# EAGLE design R401D (EAGLE 6.6.0)
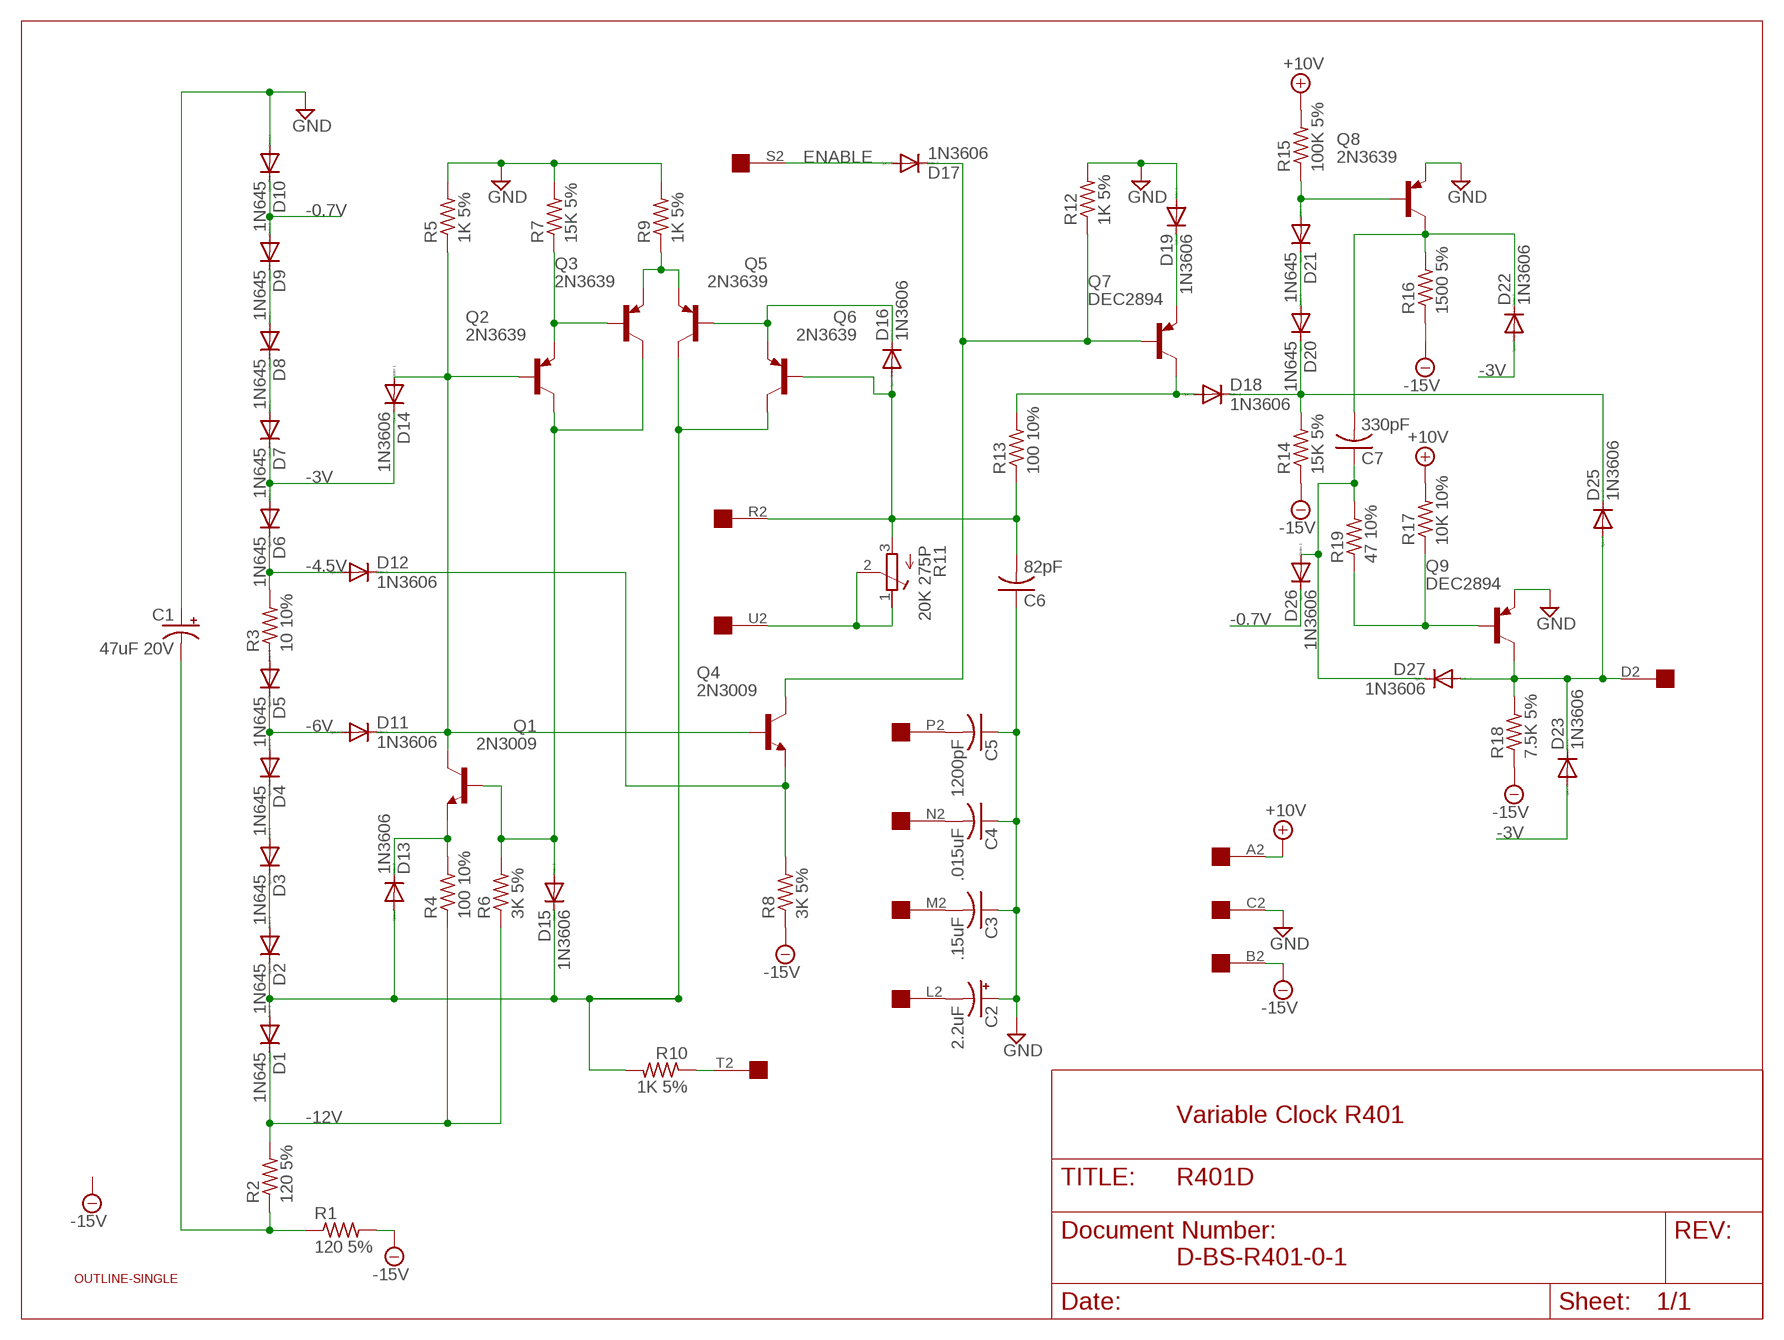
[diagram p0: schematic, sheet 1]

## Parts
C1  47uF 20V  CPOL-USE22-6AXIAL  [E22-6]
C2  2.2uF  CPOL-USE12-4AXIAL  [E12-4]
C3  .15uF  C-US275-093X316  [C275-093X316]
C4  .015uF  C-US150-054X183  [C150-054X183]
C5  1200pF  C-US102-043X133  [C102-043X133]
C6  82pF  C-US075-032X103  [C075-032X103]
C7  330pF  C-US075-032X103  [C075-032X103]
D1  1N645  1N4148DO35-10  [DO35-10]
D2  1N645  1N4148DO35-10  [DO35-10]
D3  1N645  1N4148DO35-10  [DO35-10]
D4  1N645  1N4148DO35-10  [DO35-10]
D5  1N645  1N4148DO35-10  [DO35-10]
D6  1N645  1N4148DO35-10  [DO35-10]
D7  1N645  1N4148DO35-10  [DO35-10]
D8  1N645  1N4148DO35-10  [DO35-10]
D9  1N645  1N4148DO35-10  [DO35-10]
D10  1N645  1N4148DO35-10  [DO35-10]
D11  1N3606  1N4148DO35-10  [DO35-10]
D12  1N3606  1N4148DO35-10  [DO35-10]
D13  1N3606  1N4148DO35-10  [DO35-10]
D14  1N3606  1N4148DO35-10  [DO35-10]
D15  1N3606  1N4148DO35-10  [DO35-10]
D16  1N3606  1N4148DO35-10  [DO35-10]
D17  1N3606  1N4148DO35-10  [DO35-10]
D18  1N3606  1N4148DO35-10  [DO35-10]
D19  1N3606  1N4148DO35-10  [DO35-10]
D20  1N645  1N4148DO35-10  [DO35-10]
D21  1N645  1N4148DO35-10  [DO35-10]
D22  1N3606  1N4148DO35-10  [DO35-10]
D23  1N3606  1N4148DO35-10  [DO35-10]
D25  1N3606  1N4148DO35-10  [DO35-10]
D26  1N3606  1N4148DO35-10  [DO35-10]
D27  1N3606  1N4148DO35-10  [DO35-10]
Q1  2N3009  2N2102  [TO5]
Q2  2N3639  2N2904  [TO39]
Q3  2N3639  2N2904  [TO39]
Q4  2N3009  2N2102  [TO5]
Q5  2N3639  2N2904  [TO39]
Q6  2N3639  2N2904  [TO39]
Q7  DEC2894  2N2904  [TO39]
Q8  2N3639  2N2904  [TO39]
Q9  DEC2894  2N2904  [TO39]
R1  120 5%  R-US_0207/10  [0207/10]
R2  120 5%  R-US_0207/10  [0207/10]
R3  10 10%  R-US_0207/10  [0207/10]
R4  100 10%  R-US_0207/10  [0207/10]
R5  1K 5%  R-US_0207/10  [0207/10]
R6  3K 5%  R-US_0207/10  [0207/10]
R7  15K 5%  R-US_0207/10  [0207/10]
R8  3K 5%  R-US_0207/10  [0207/10]
R9  1K 5%  R-US_0207/10  [0207/10]
R10  1K 5%  R-US_0207/10  [0207/10]
R11  20K 275P  275P  [3006Y]
R12  1K 5%  R-US_0207/10  [0207/10]
R13  100 10%  R-US_0207/10  [0207/10]
R14  15K 5%  R-US_0207/10  [0207/10]
R15  100K 5%  R-US_0207/10  [0207/10]
R16  1500 5%  R-US_0207/10  [0207/10]
R17  10K 10%  R-US_0207/10  [0207/10]
R18  7.5K 5%  R-US_0207/10  [0207/10]
R19  47 10%  R-US_0207/10  [0207/10]
U$1  OUTLINE-SINGLE  [SINGLE]
U$2  EDGE-1  [EDGE-CON1]

## Nets
+10V [Supply]: R15.2 R17.2 U$2.A2
-0.7V [Supply]: D9.A D10.C D26.C
-3V [Supply]: D6.A D7.C D14.C D22.A D23.A
-4.5V [Supply]: D6.C D12.A R3.2
-6V [Supply]: D4.A D5.C D11.A
-12V [Supply]: D1.C R2.2 R4.1 R6.1
-15V [Supply]: R1.2 R8.1 R14.1 R16.1 R18.1 U$2.B2
ENABLE: D17.A U$2.S2
GND [Supply]: C1.+ C2.+ C3.1 C4.1 C5.1 C6.1 D10.A D19.A Q8.1(E) Q9.1(E) R5.2 R7.2 R9.2 R12.2 U$2.C2
N$1 [Supply]: C1.- R1.1 R2.1
N$6: D5.A R3.1
N$7: D11.C D14.A Q1.3(C) Q2.2(B) Q4.2(B) R5.1
N$8 [Supply]: D8.A D9.C
N$9 [Supply]: D7.A D8.C
N$10: D13.C Q1.1(E) R4.2
N$11: D15.A Q1.2(B) Q2.3(C) Q3.3(C) R6.2
N$12 [Supply]: D1.A D2.C D13.A D15.C Q5.3(C) Q6.3(C) R10.2
N$13 [Supply]: D2.A D3.C
N$14 [Supply]: D3.A D4.C
N$15: Q2.1(E) Q3.2(B) R7.1
N$16: Q3.1(E) Q5.1(E) R9.1
N$17: D12.C Q4.1(E) R8.2
N$18: D16.C Q5.2(B) Q6.1(E)
N$19: C6.2 D16.A Q6.2(B) R11.3(E) R13.1 U$2.R2
N$20: R11.1(A) R11.2(S) U$2.U2
N$21: D17.C Q4.3(C) Q7.2(B) R12.1
N$22: D19.C Q7.1(E)
N$23: D18.A Q7.3(C) R13.2
N$24: C4.2 U$2.N2
N$25: D23.C D25.A D27.A Q9.3(C) R18.2 U$2.D2
N$26: C3.2 U$2.M2
N$27: C2.- U$2.L2
N$28: C5.2 U$2.P2
N$29: D21.A Q8.2(B) R15.1
N$30: D20.A D21.C
N$32: C7.2 D22.C Q8.3(C) R16.2
N$33: D18.C D20.C D25.C R14.2
N$34: Q9.2(B) R17.1 R19.1
N$35: C7.1 D26.A D27.C R19.2
N$37: R10.1 U$2.T2
Unconnected: U$2.E2 U$2.F2 U$2.H2 U$2.J2 U$2.K2 U$2.V2

## Notes on the sheet
- Variable Clock R401
- D-BS-R401-0-1

## Library data of the parts
C1 = rcl:CPOL-US: POLARIZED CAPACITOR, American symbol
C2 = dec-con:CPOL-USE12-4AXIAL: 0.5" veresion of an electrolytic
C3-C7 = rcl:C-US: CAPACITOR, American symbol
D1-D23 D25-D27 = diode:1N4148: DIODE high speed (Philips)
Q1 Q4 = transistor-npn:2N2102: NPN Transistor
Q2 Q3 Q5-Q9 = transistor-pnp:2N2904*: PNP Transistror
R1-R10 R12-R19 = rcl:R-US_: RESISTOR, American symbol
R11 = dec-con:275P: Trimpot with 275P (3006Y) footprint.
U$1 = dec-con:OUTLINE-*: Board outlines for DEC boards.
U$2 = dec-con:EDGE-1: Single-Sided DEC Edge Connector -- (side 2)

## Net classes
1 Supply: width 0.813 mm

## Board
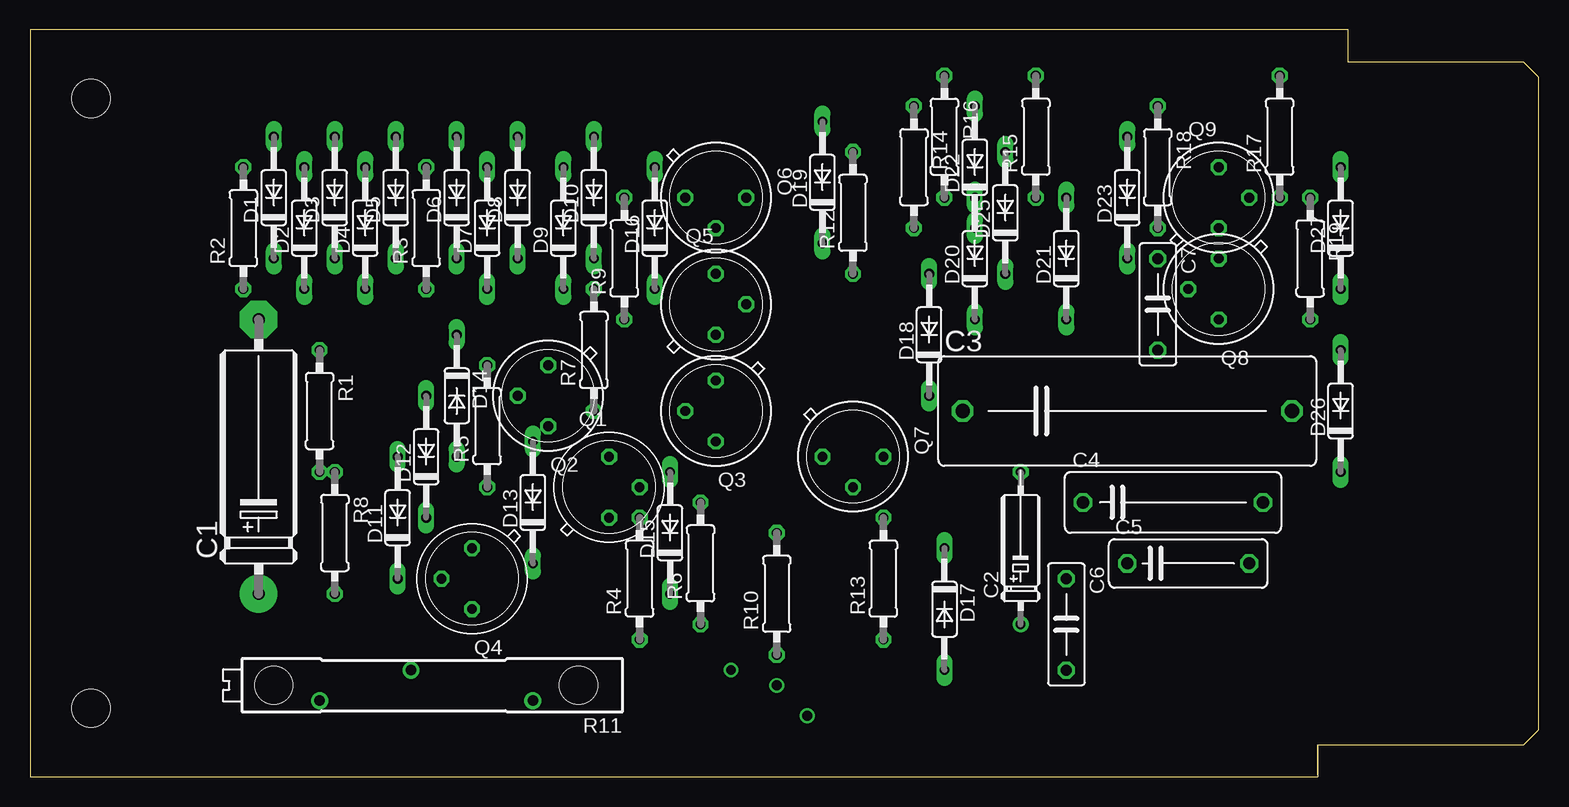
[diagram p1: board, top side]
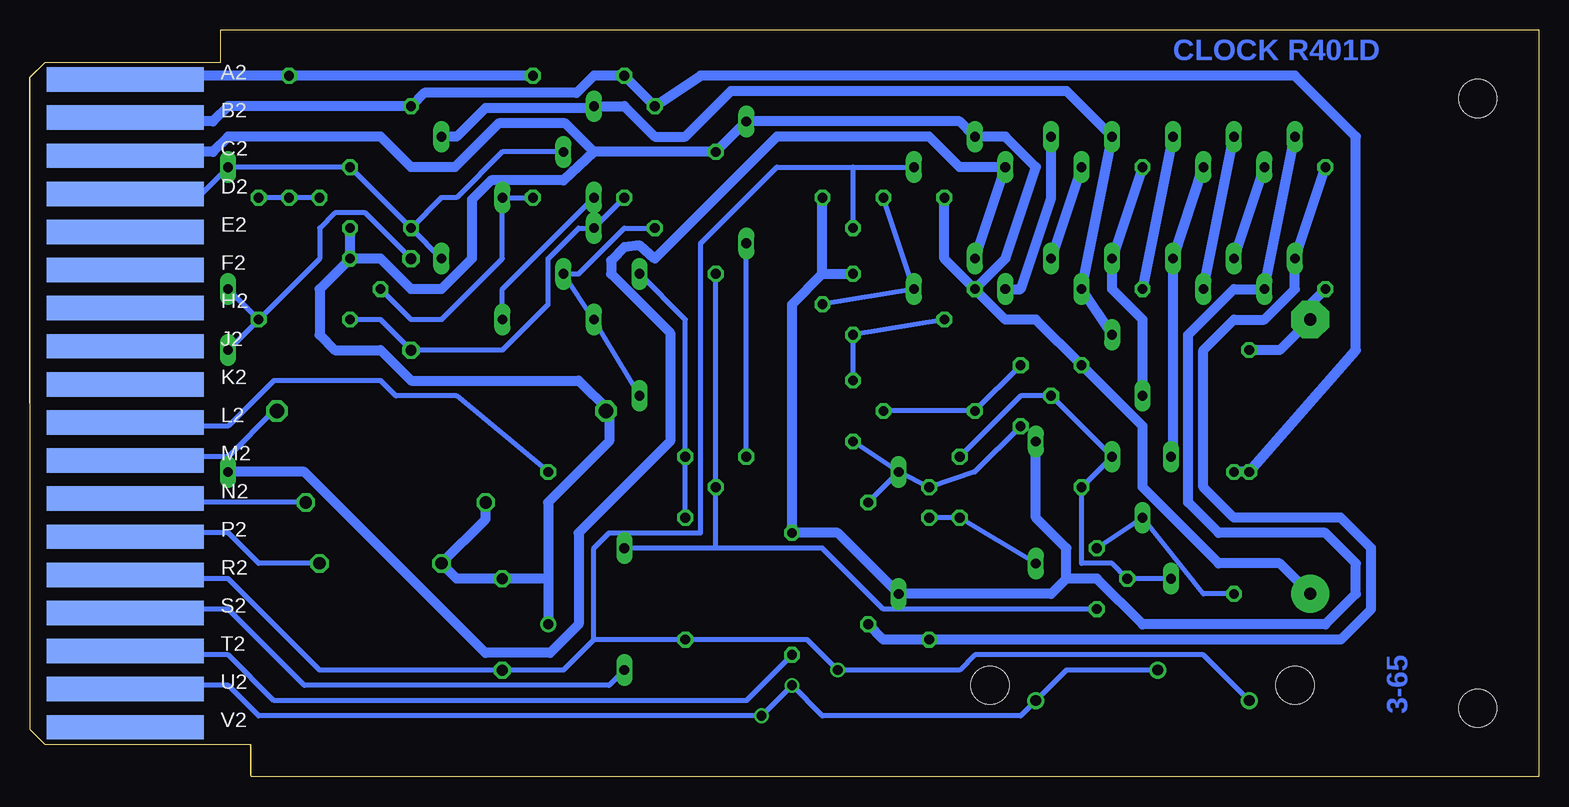
[diagram p2: board, bottom side, seen from below]

Size 125.73 x 62.23 mm. Coordinates in mm from the lower left corner, seen from the top.
Copper layers (1+16): Top 0.035mm / dielectric 1.5mm / Bottom 0.035mm
Design rules "16mils": minimum track width 16mil, minimum drill 32mil, track to track 15mil, track to pad 10mil, pad to pad 10mil, via to via 10mil, smd to smd 10mil, copper to edge 13mil, drill to drill 10mil, minimum pad ring 10mil, minimum via ring 8mil, stop-mask expansion 0mil, vias tented up to drill 0mil, thermal gap 10mil
Holes 3.17 mm at 20.32,7.62 45.72,7.62

### Footprints (pad centres in the part's own frame; a part is rotated, then mirrored left to right if it is on the bottom)
E22-6 = drill 1.016 pad 3.15: + -11.43,0 | drill 1.016 pad 3.15 octagon: - 11.43,0
E12-4 = drill 0.813: + -7.62,0 | drill 0.813 octagon: - 5.08,0
C275-093X316 = drill 1.194 octagon: 1 -13.716,0; 2 13.716,0
C150-054X183 = drill 1.016 octagon: 1 -7.493,0; 2 7.493,0
C102-043X133 = drill 1.016 octagon: 1 -5.08,0; 2 5.08,0
C075-032X103 = drill 0.914 octagon: 1 -3.81,0; 2 3.81,0
DO35-10 = drill 0.813 long: A 5.08,0; C -5.08,0
TO5 = drill 0.813 octagon: 1 0,-2.54; 2 2.54,0; 3 0,2.54
TO39 = drill 0.813 octagon: 1 0,-2.54; 2 2.54,0; 3 0,2.54
0207/10 = drill 0.813 octagon: 1 -5.08,0; 2 5.08,0
3006Y = drill 0.9: 1 -8.89,1.27; 2 1.27,-1.27; 3 8.89,1.27
SINGLE = hole 3.175: 120.65,56.515; 120.65,5.715
EDGE-CON1 = smd 13.106 x 2.032 bottom: A2 7.938,4.128; B2 7.938,7.303; C2 7.938,10.477; D2 7.938,13.652; E2 7.938,16.828; F2 7.938,20.003; H2 7.938,23.177; J2 7.938,26.352; K2 7.938,29.527; L2 7.938,32.703; M2 7.938,35.877; N2 7.938,39.053; P2 7.938,42.227; R2 7.938,45.403; S2 7.938,48.578; T2 7.938,51.752; U2 7.938,54.928; V2 7.938,58.102

### Placement (x,y rotation side)
C1  19.05,26.67 90 top
C2  82.55,20.32 90 top
C3  91.44,30.48 0 top
C4  95.25,22.86 0 top
C5  96.52,17.78 0 top
C6  86.36,12.7 270 top
C7  93.98,39.37 270 top
D1  20.32,48.26 90 top
D2  22.86,45.72 90 top
D3  25.4,48.26 90 top
D4  27.94,45.72 90 top
D5  30.48,48.26 90 top
D6  35.56,48.26 90 top
D7  38.1,45.72 90 top
D8  40.64,48.26 90 top
D9  44.45,45.72 90 top
D10  46.99,48.26 90 top
D11  30.64,21.59 90 top
D12  33.02,26.67 90 top
D13  41.91,22.86 90 top
D14  35.56,31.75 270 top
D15  53.34,20.32 90 top
D16  52.07,45.72 90 top
D17  76.2,13.97 270 top
D18  74.93,36.83 90 top
D19  66.04,49.53 90 top
D20  78.74,43.18 90 top
D21  86.36,43.18 90 top
D22  78.74,50.8 90 top
D23  91.44,48.26 90 top
D25  81.28,46.99 90 top
D26  109.22,30.48 90 top
D27  109.22,45.72 90 top
Q1  48.26,24.13 0 top
Q2  43.18,31.75 180 top
Q3  57.15,30.48 180 top
Q4  36.83,16.51 180 top
Q5  57.15,39.37 0 top
Q6  57.15,48.26 270 top
Q7  68.58,26.67 270 top
Q8  99.06,40.64 180 top
Q9  99.06,48.26 0 top
R1  24.13,30.48 270 top
R2  17.78,45.72 90 top
R3  33.02,45.72 90 top
R4  50.8,16.51 90 top
R5  38.1,29.21 90 top
R6  55.88,17.78 90 top
R7  46.99,35.56 90 top
R8  25.4,20.32 270 top
R9  49.53,43.18 90 top
R10  62.23,15.24 90 top
R11  33.02,7.62 180 top
R12  68.58,46.99 90 top
R13  71.12,16.51 90 top
R14  73.66,50.8 270 top
R15  83.82,53.34 90 top
R16  76.2,53.34 270 top
R17  104.14,53.34 90 top
R18  93.98,50.8 270 top
R19  106.68,43.18 270 top
U$1  125.73,62.23 180 top
U$2  125.73,62.23 180 top

### Tracks (layer width: path | path; a pad name or v marks a point on that pad's centre or on a via)
+10V
  Bottom 0.813: U$2.A2 116.84,58.04 116.84,58.42 R17.2 R15.2
-0.7V
  Bottom 0.813: D10.C D9.A 48.26,50.8 50.8,53.34 63.5,53.34 73.66,43.18 74.93,44.29 76.2,44.13 77.31,43.02 77.31,41.91 72.39,36.99 72.39,27.94 80.01,20.32 80.01,12.7 82.39,10.32 87.79,10.32 102.87,25.4 D26.C
-3V
  Bottom 0.813: D23.A 90.17,53.34 87.79,55.72 78.9,55.72 D22.A 76.2,55.88 73.66,53.34 71.12,53.34 67.31,57.15 39.37,57.15 D6.A D7.C D14.C
-4.5V
  Bottom 0.813: D12.A 33.02,38.1 35.56,40.64 D6.C R3.2
-6V
  Bottom 0.813: D11.A 30.48,26.67 D5.C D4.A
-12V
  Bottom 0.813: R2.2 D1.C 20.32,40.64 22.86,38.1 25.4,38.1 27.94,35.56 27.94,24.13 25.4,21.59 16.51,21.59 13.97,19.05 13.97,13.97 16.51,11.43 R4.1 54.61,11.43 R6.1
-15V
  Bottom 0.813: U$2.B2 117.13,54.9 116.84,54.61 110.49,54.61 109.22,55.88 R18.1 92.87,56.99 80.17,56.99 78.74,58.42 R16.1 R14.1 69.85,58.42 20.32,58.42 15.24,53.34 15.24,35.56 R1.2 R8.1
ENABLE
  Bottom 0.406: U$2.S2 117.14,13.66 116.84,13.97 109.22,13.97 102.87,7.62 77.47,7.62 D17.A
GND
  Bottom 0.813: C4.1 87.76,21.46 C5.1 90.17,16.51 C6.1 82.55,16.51 | 77.47,30.48 C3.1 | 82.55,16.51 C2.+ | 82.55,16.51 82.55,22.86 77.47,27.94 77.47,30.48 | U$2.C2 117.17,51.74 116.84,52.07 110.49,52.07 109.22,53.34 96.52,53.34 93.98,50.8 90.33,50.8 86.68,54.45 81.12,54.45 78.74,52.07 | Q8.1 Q9.1 | Q8.1 96.52,43.18 93.98,40.64 91.44,40.64 88.9,43.18 88.9,48.1 87.31,49.69 81.28,49.69 78.74,52.07 | 77.47,30.48 80.01,33.02 93.98,33.02 96.52,35.56 100.33,35.56 101.6,36.83 101.6,40.64 Q8.1 | C1.+ 21.59,17.78 26.67,17.78 33.02,24.13 33.02,29.21 R5.2 41.91,38.1 44.45,38.1 R7.2 | 78.74,52.07 R12.2 D19.A 48.26,54.61 D10.A 44.45,53.34 41.91,50.8 44.45,43.18 R7.2 | R7.2 49.53,43.18 R9.2
N$1
  Bottom 0.813: R1.1 21.59,35.56 C1.- 19.05,39.37 R2.1
N$6
  Bottom 0.813: R3.1 D5.A
N$7
  Bottom 0.406: D11.C Q4.2 35.56,17.78 38.1,17.78 R5.1 D14.A Q2.2 43.18,31.75 Q1.3
N$8
  Bottom 0.813: D9.C 43.18,40.64 40.64,48.26 D8.A
N$9
  Bottom 0.813: D8.C D7.A
N$10
  Bottom 0.406: D13.C Q1.1 R4.2
N$11
  Bottom 0.406: D15.A Q1.2 46.99,25.4 Q2.3 | D15.A Q3.3 | D15.A R6.2
N$12
  Bottom 0.813: D1.A D2.C 25.4,40.64 29.21,36.83 29.21,22.86 26.67,20.32 17.78,20.32 15.24,17.78 15.24,15.24 17.78,12.7 33.02,12.7 36.83,16.51 39.37,16.51 | 39.37,16.51 40.64,15.24 D15.C 58.42,20.32 R10.2 62.23,39.37 59.69,41.91 | D13.A 41.91,21.59 39.37,19.05 39.37,16.51 | 59.69,41.91 Q5.3 | 59.69,41.91 Q6.3
N$13
  Bottom 0.813: D3.C D2.A
N$14
  Bottom 0.813: D4.C D3.A
N$15
  Bottom 0.406: Q2.1 R7.1 Q3.2
N$16
  Bottom 0.406: R9.1 Q5.1 Q3.1
N$17
  Bottom 0.406: Q4.1 D12.C 27.94,15.24 R8.2
N$18
  Bottom 0.406: Q5.2 D16.C Q6.1
N$19  (via drill 0.81)
  Bottom 0.406: R11.3 27.94,10.16 46.99,10.16 48.26,8.89 v58.42,8.89 60.96,11.43 R13.1 78.74,11.43 | U$2.R2 117.17,16.84 116.84,16.51 109.22,16.51 101.6,8.89 C6.2 81.28,8.89 78.74,11.43 | 78.74,11.43 78.74,19.05 77.47,20.32 69.85,20.32 69.85,27.94 69.85,44.45 63.5,50.8 57.15,50.8 | 57.15,50.8 D16.A | 57.15,50.8 Q6.2
N$20  (via drill 0.81)
  Bottom 0.406: U$2.U2 117.2,7.26 116.84,7.62 109.22,7.62 106.68,5.08 v64.77,5.08 | v62.23,7.62 v64.77,5.08 | R11.2 39.37,8.89 R11.1 43.18,5.08 59.69,5.08 v62.23,7.62 | v62.23,7.62 v64.77,5.08
N$21
  Bottom 0.406: 68.58,19.05 D17.C | 68.58,19.05 Q7.2 R12.1 | Q4.3 54.61,13.97 59.69,19.05 68.58,19.05
N$22
  Bottom 0.406: Q7.1 D19.C
N$23
  Bottom 0.406: R13.2 Q7.3 71.12,38.1 D18.A
N$24
  Bottom 0.406: U$2.N2 117.17,23.19 116.84,22.86 C4.2
N$25
  Bottom 0.406: U$2.D2 116.84,48.56 116.84,48.26 111.76,48.26 D27.A Q9.3 R18.2 | R18.2 D23.C | D25.A 86.36,52.07 90.17,48.26 91.44,48.26 R18.2
N$26
  Bottom 0.406: U$2.M2 117.17,26.34 116.84,26.67 109.22,26.67 105.41,30.48 C3.2
N$27
  Bottom 0.406: U$2.L2 117.17,29.54 116.84,29.21 109.22,29.21 105.41,33.02 96.52,33.02 95.25,31.75 90.17,31.75 C2.-
N$28
  Bottom 0.406: U$2.P2 117.17,19.99 116.84,20.32 109.22,20.32 106.68,17.78 C5.2
N$29
  Bottom 0.406: R15.1 D21.A 86.36,43.18 91.44,38.1 93.98,38.1 Q8.2
N$30
  Bottom 0.406: D20.A 86.36,40.64 D21.C
N$32
  Bottom 0.406: Q8.3 96.52,38.1 C7.2 86.36,35.56 82.55,39.37 82.55,43.18 80.01,45.72 D22.C R16.2
N$33
  Bottom 0.406: D18.C D20.C D25.C 80.01,41.91 76.2,45.72 R14.2
N$34
  Bottom 0.406: Q9.2 R17.1 R19.1
N$35
  Bottom 0.406: R19.2 D27.C | R19.2 D26.A | C7.1 97.79,46.99 100.33,46.99 101.6,45.72 101.6,43.18 R19.2
N$37
  Bottom 0.406: U$2.T2 117.17,10.49 116.84,10.16 109.22,10.16 105.41,6.35 66.04,6.35 R10.1

### Text on the board
Bottom: CLOCK R401D | 3-65
200bmp: C:/Users/Vince/Documents/websvn/trunk/Eagle/projects/DEC/Rxxx/R401/R401Cbackf.bmp